# EasyEDA Pro project Car.eprj, schematic Schematic2
Board Name: Board2; Create Date: 2025-08-16; Page Name: P1; Project Name: Car; Schematic Name: Schematic2; Update Date: 2025-08-16; Company: EasyEDA.com; Page Size: A4; Version: V1.0
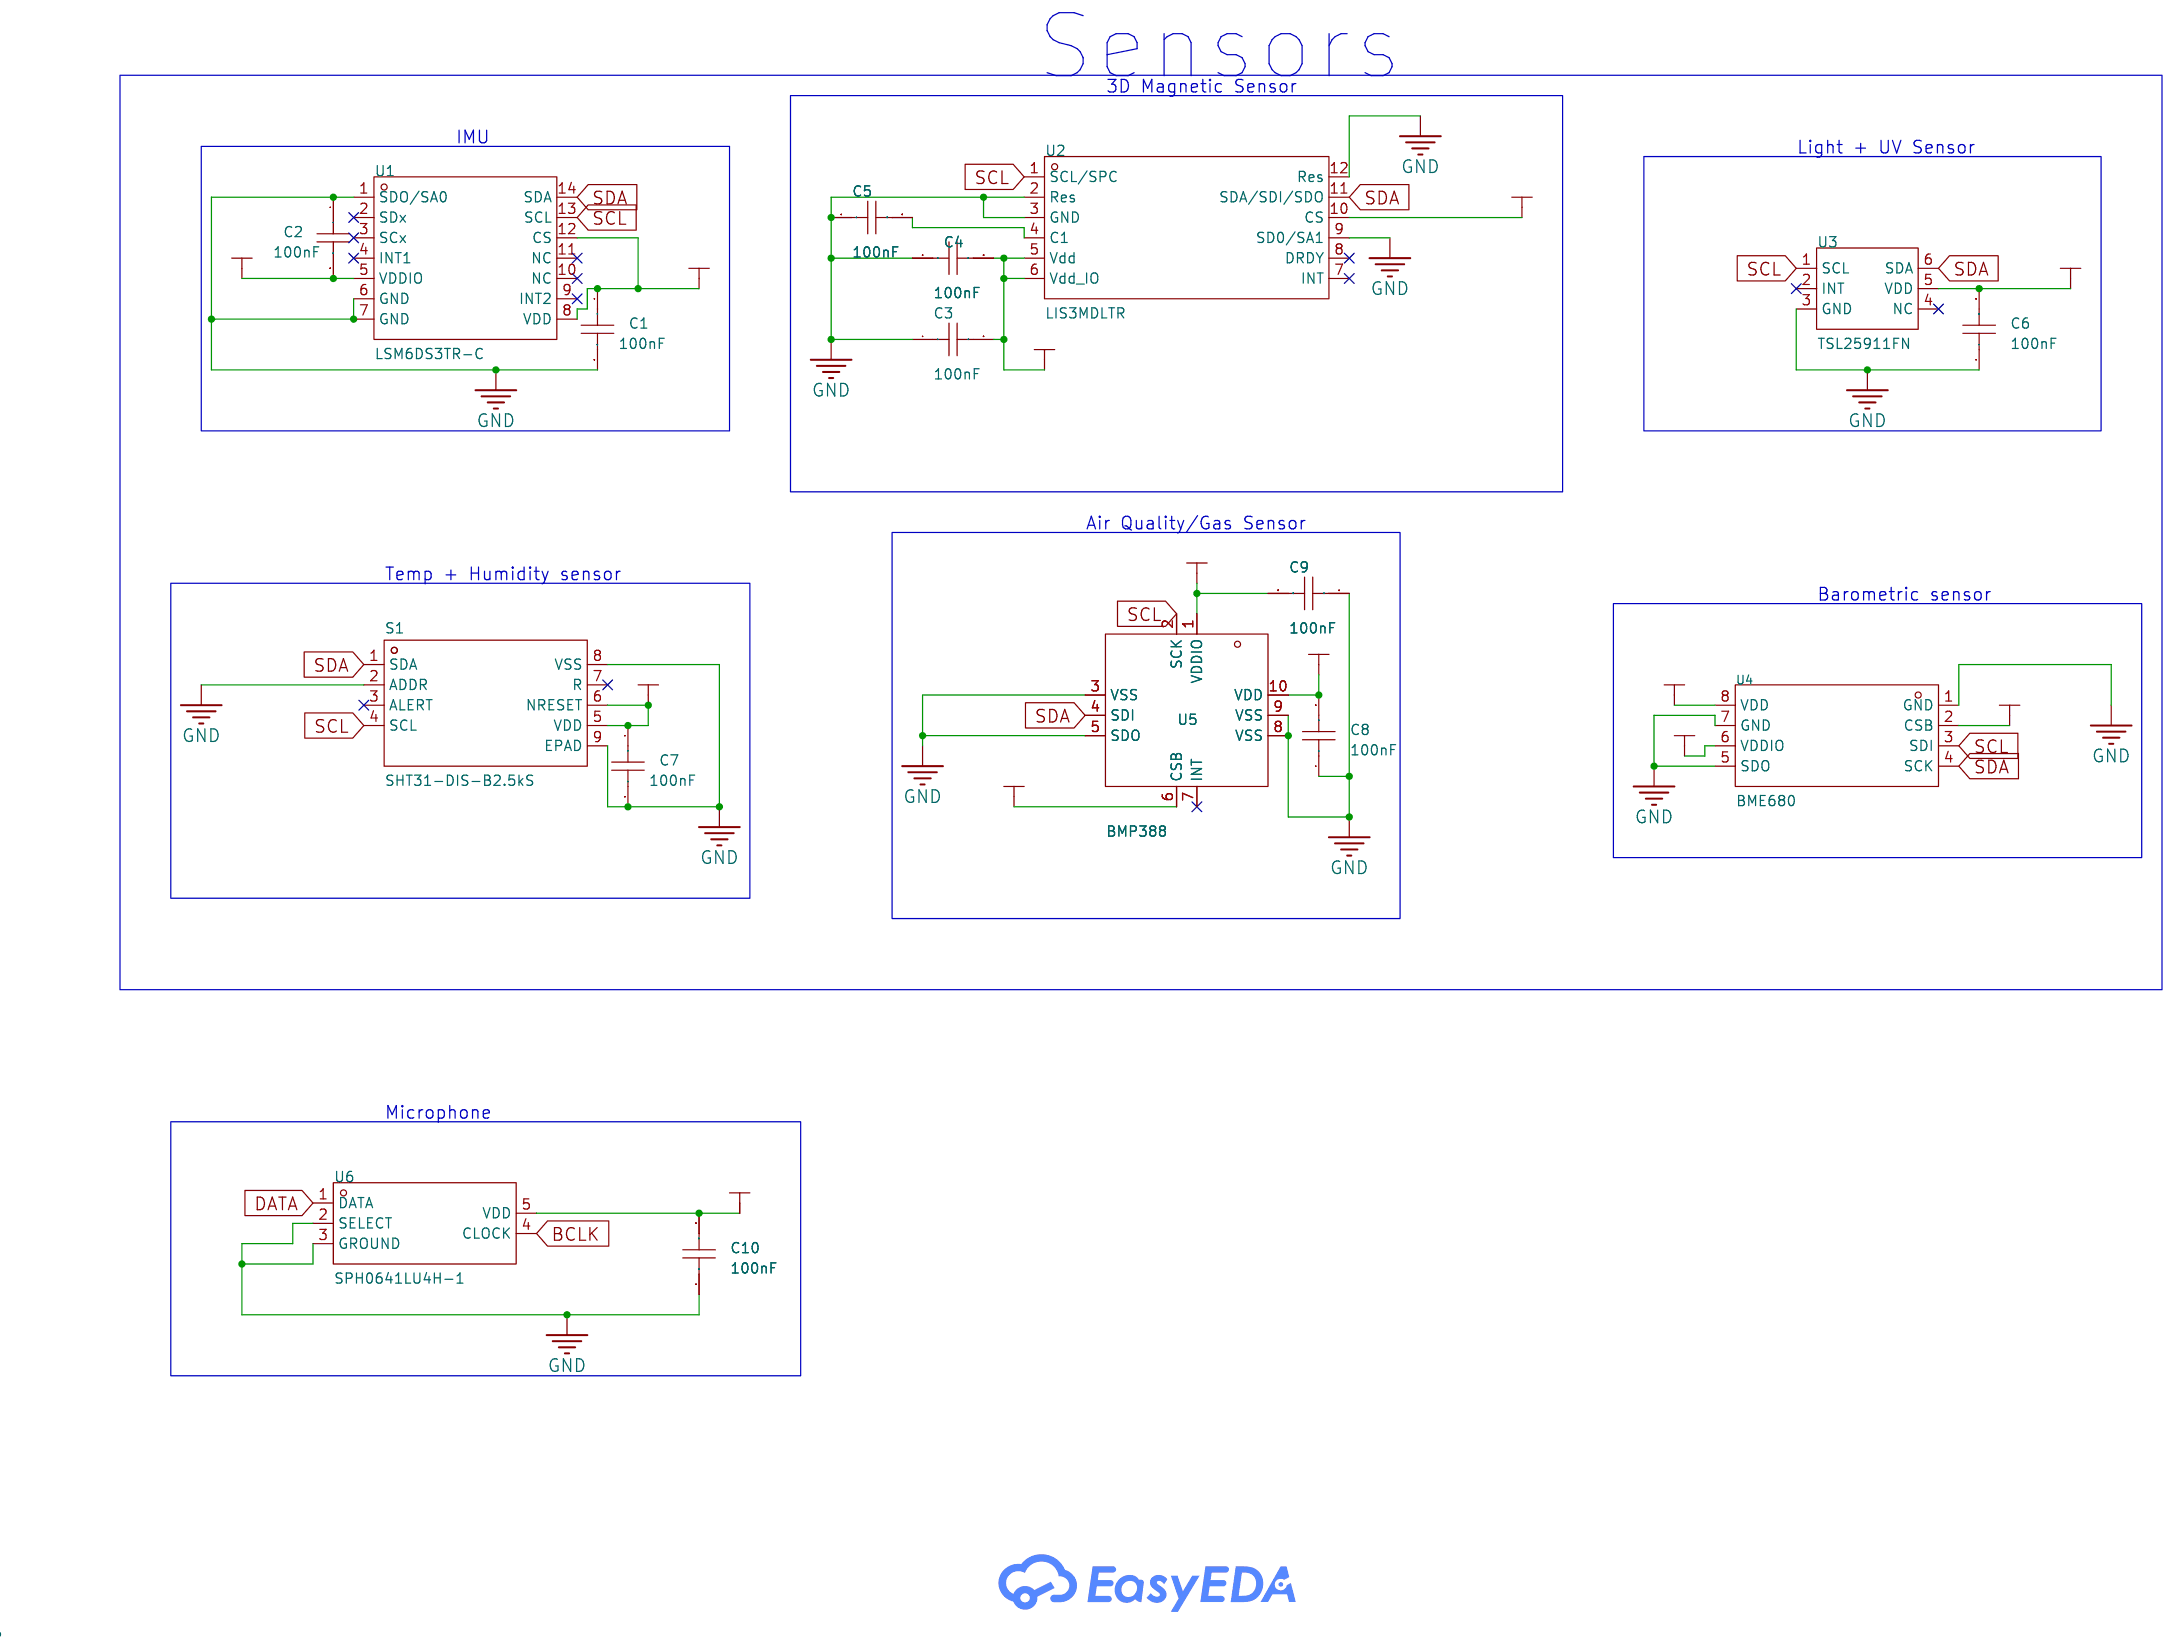
[diagram p1: schematic sheet]

## Parts
C1  100nF  [C0402]
C2  100nF  [C0402]
C3  100nF  [C0402]
C4  100nF  [C0402]
C5  100nF  [C0402]
C6  100nF  [C0402]
C7  100nF  [C0402]
C8  100nF  [C0402]
C9  100nF  [C0402]
C10  100nF  [C0402]
S1  SHT31-DIS-B2.5kS  [DFN-8_L2.5-W2.5-P0.50-BL-EP]
U1  LSM6DS3TR-C  [LGA-14_L3.0-W2.5-P0.50-TL]
U2  LIS3MDLTR  [LGA-12_L2.0-W2.0-P0.50-BL]
U3  TSL25911FN  [DFN-6_L2.4-W2.0-P0.65-BL]
U4  BME680  [LGA-8_L3.0-W3.0-P0.80-TR]
U5  BMP388  [SENSORM-SMD_BMP388]
U6  SPH0641LU4H-1  [MIC-SMD_5P_L3.5-W2.7-P0.82_SPH0641LU4H-1]

## Library data of the parts
C1-C10 = CL05B104KO5NNNC: LCSC Part Name: 100nF ±10% 16V; Supplier Part: C1525; Manufacturer: SAMSUNG(三星); Supplier Footprint: 0402; JLCPCB Part Class: Basic Part; Datasheet: https://atta.szlcsc.com/upload/public/pdf/source/20160218/1457707763339.pdf; Supplier: LCSC; Tolerance: ±10%
S1 = SHT31-DIS-B2.5kS: LCSC Part Name: 1-101386-01; Supplier Part: C80862; Manufacturer: Sensirion(瑞士盛思锐); Supplier Footprint: DFN-8-EP(2.5x2.5); JLCPCB Part Class: Extended Part; Datasheet: https://atta.szlcsc.com/upload/public/pdf/source/20230202/324039AB95BA3D329FC29BEE4FBFDB91.pdf; Supplier: LCSC; Supply Voltage: 2.15V~5.5V
U1 = LSM6DS3TR-C: LCSC Part Name: IMU-惯性测量单元; Supplier Part: C967633; Manufacturer: ST(意法半导体); Supplier Footprint: LGA-14(2.5x3); JLCPCB Part Class: Extended Part; Datasheet: https://item.szlcsc.com/datasheet/LSM6DS3TR-C/1054343.html; Supplier: LCSC; Sensor Type: Accelerometer Gyroscope; Operating Temperature: -40℃~+85℃
U2 = LIS3MDLTR: LCSC Part Name: 三轴数字磁传感器; Supplier Part: C478483; Manufacturer: ST(意法半导体); Supplier Footprint: LGA-12(2x2); JLCPCB Part Class: Extended Part; Datasheet: https://atta.szlcsc.com/upload/public/pdf/source/20191231/C478483_325C07DDDEF2D93C2E541FB70AD6AC5C.pdf; Supplier: LCSC
U3 = TSL25911FN: Supplier Part: C176812; Manufacturer: ams(艾迈斯半导体); Supplier Footprint: DFN-6(2x2.2); JLCPCB Part Class: Extended Part; Datasheet: https://atta.szlcsc.com/upload/public/pdf/source/20221101/8F074A1F64844737441CC7E29B2E0EE7.pdf; Supplier: LCSC
U4 = BME680: Supplier Part: C125972; Manufacturer: Bosch(博世); Supplier Footprint: LGA-8; JLCPCB Part Class: Extended Part; Datasheet: https://atta.szlcsc.com/upload/public/pdf/source/20180327/C125972_A896D04D1D4DD1EE7894A8064AE337BE.pdf; Supplier: LCSC; Operating Temperature: -40℃~+85℃
U5 = BMP388: Supplier Part: C779278; Manufacturer: Bosch(博世); Supplier Footprint: LGA-10(2x2); JLCPCB Part Class: Extended Part; Datasheet: https://atta.szlcsc.com/upload/public/pdf/source/20211019/91C230A1D32F1E776DA878FFB43C8B15.pdf; Supplier: LCSC; Pressure range: 30Kpa~125Kpa; Voltage - Supply: 1.65V~3.6V
U6 = SPH0641LU4H-1: Supplier Part: C2879853; Manufacturer: Knowles(楼氏); JLCPCB Part Class: Extended Part; Datasheet: https://atta.szlcsc.com/upload/public/pdf/source/20210820/C2879853_F49B0A002AD8847A1ABF8F58BC58F22C.pdf; Supplier: LCSC

## Nets
+3V3: C1.1 C2.2 C3.2 C4.2 C6.2 C7.1 C8.2 C9.2 C10.2 S1.5(VDD) S1.6(NRESET) U1.5(VDDIO) U1.8(VDD) U1.12(CS) U2.5(Vdd) U2.6(Vdd_IO) U2.10(CS) U3.5(VDD) U4.2(CSB) U4.6(VDDIO) U4.8(VDD) U5.1(VDDIO) U5.6(CSB) U5.10(VDD) U6.5(VDD)
GND: C1.2 C2.1 C3.1 C4.1 C5.1 C6.1 C7.2 C8.1 C9.1 C10.1 S1.2(ADDR) S1.8(VSS) S1.9(EPAD) U1.1(SDO/SA0) U1.6(GND) U1.7(GND) U2.2(Res) U2.3(GND) U2.9(SD0/SA1) U2.12(Res) U3.3(GND) U4.1(GND) U4.5(SDO) U4.7(GND) U5.3(VSS) U5.5(SDO) U5.8(VSS) U5.9(VSS) U6.2(SELECT) U6.3(GROUND)
BCLK: U6.4(CLOCK)
DATA: U6.1(DATA)
SCL: S1.4(SCL) U1.13(SCL) U2.1(SCL/SPC) U3.1(SCL) U4.3(SDI) U5.2(SCK)
SDA: S1.1(SDA) U1.14(SDA) U2.11(SDA/SDI/SDO) U3.6(SDA) U4.4(SCK) U5.4(SDI)
$1N1143: C5.2 U2.4(C1)

Not connected (* = marked no-connect by the designer): S1 3(ALERT)* 7(R)*; U1 2(SDx)* 3(SCx)* 4(INT1)* 9(INT2)* 10(NC)* 11(NC)*; U2 7(INT)* 8(DRDY)*; U3 2(INT)* 4(NC)*; U5 7(INT)*

## Notes on the sheet
- Sensors
- 3D Magnetic Sensor
- IMU
- Light + UV Sensor
- Air Quality/Gas Sensor
- Temp + Humidity sensor
- Barometric sensor
- Microphone
